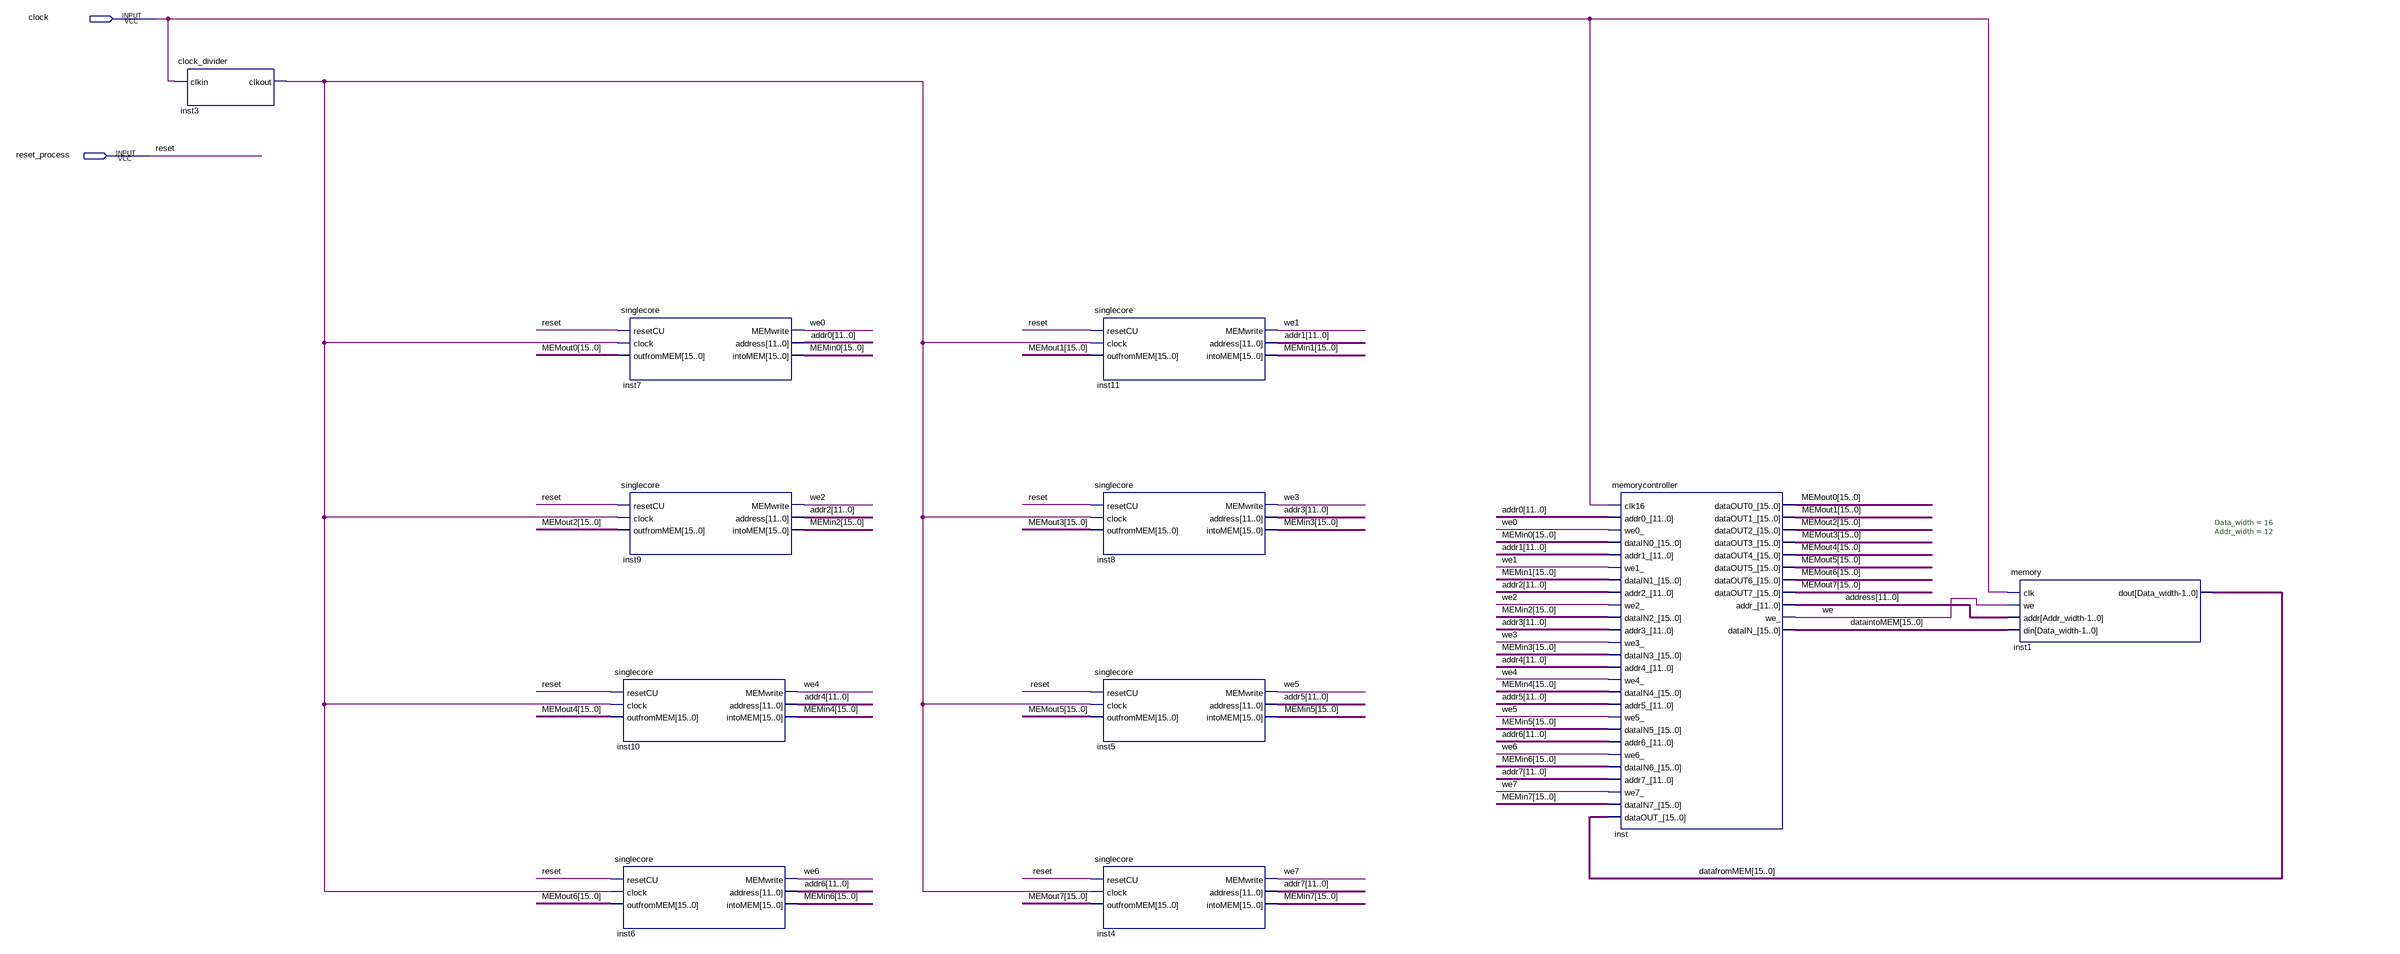
[diagram p0: schematic sheet]
// Quartus schematic Octacore_processor.bdf as structural Verilog: 11 symbols, 2 pins
module Octacore_processor (
  input  clock,
  input  reset_process
);

  wire inst3_clkout, we, we0, we1, we2, we3, we4, we5, we6, we7;
  wire [11:0] addr0, addr1, addr2, addr3, addr4, addr5, addr6, addr7, address;
  wire [15:0] datafromMEM, dataintoMEM, MEMin0, MEMin1, MEMin2, MEMin3, MEMin4, MEMin5, MEMin6, MEMin7,
       MEMout0, MEMout1, MEMout2, MEMout3, MEMout4, MEMout5, MEMout6, MEMout7;

  clock_divider inst3 (.clkin(clock), .clkout(inst3_clkout));
  singlecore inst10 (
    .resetCU(reset_process), .clock(inst3_clkout), .outfromMEM(MEMout4), .MEMwrite(we4), .address(addr4),
    .intoMEM(MEMin4));
  singlecore inst6 (
    .resetCU(reset_process), .clock(inst3_clkout), .outfromMEM(MEMout6), .MEMwrite(we6), .address(addr6),
    .intoMEM(MEMin6));
  singlecore inst7 (
    .resetCU(reset_process), .clock(inst3_clkout), .outfromMEM(MEMout0), .MEMwrite(we0), .address(addr0),
    .intoMEM(MEMin0));
  singlecore inst9 (
    .resetCU(reset_process), .clock(inst3_clkout), .outfromMEM(MEMout2), .MEMwrite(we2), .address(addr2),
    .intoMEM(MEMin2));
  singlecore inst11 (
    .resetCU(reset_process), .clock(inst3_clkout), .outfromMEM(MEMout1), .MEMwrite(we1), .address(addr1),
    .intoMEM(MEMin1));
  singlecore inst8 (
    .resetCU(reset_process), .clock(inst3_clkout), .outfromMEM(MEMout3), .MEMwrite(we3), .address(addr3),
    .intoMEM(MEMin3));
  singlecore inst5 (
    .resetCU(reset_process), .clock(inst3_clkout), .outfromMEM(MEMout5), .MEMwrite(we5), .address(addr5),
    .intoMEM(MEMin5));
  singlecore inst4 (
    .resetCU(reset_process), .clock(inst3_clkout), .outfromMEM(MEMout7), .MEMwrite(we7), .address(addr7),
    .intoMEM(MEMin7));
  memorycontroller inst (
    .clk16(clock), .addr0_(addr0), .we0_(we0), .dataIN0_(MEMin0), .addr1_(addr1), .we1_(we1),
    .dataIN1_(MEMin1), .addr2_(addr2), .we2_(we2), .dataIN2_(MEMin2), .addr3_(addr3), .we3_(we3),
    .dataIN3_(MEMin3), .addr4_(addr4), .we4_(we4), .dataIN4_(MEMin4), .addr5_(addr5), .we5_(we5),
    .dataIN5_(MEMin5), .addr6_(addr6), .we6_(we6), .dataIN6_(MEMin6), .addr7_(addr7), .we7_(we7),
    .dataIN7_(MEMin7), .dataOUT_(datafromMEM), .dataOUT0_(MEMout0), .dataOUT1_(MEMout1), .dataOUT2_(MEMout2),
    .dataOUT3_(MEMout3), .dataOUT4_(MEMout4), .dataOUT5_(MEMout5), .dataOUT6_(MEMout6), .dataOUT7_(MEMout7),
    .addr_(address), .we_(we), .dataIN_(dataintoMEM));
  memory #(.Data_width(16), .Addr_width(12)) inst1 (
    .clk(clock), .we(we), .addr(address), .din(dataintoMEM), .dout(datafromMEM));

  // Other names for the same wires on the sheet: reset = reset_process
endmodule
